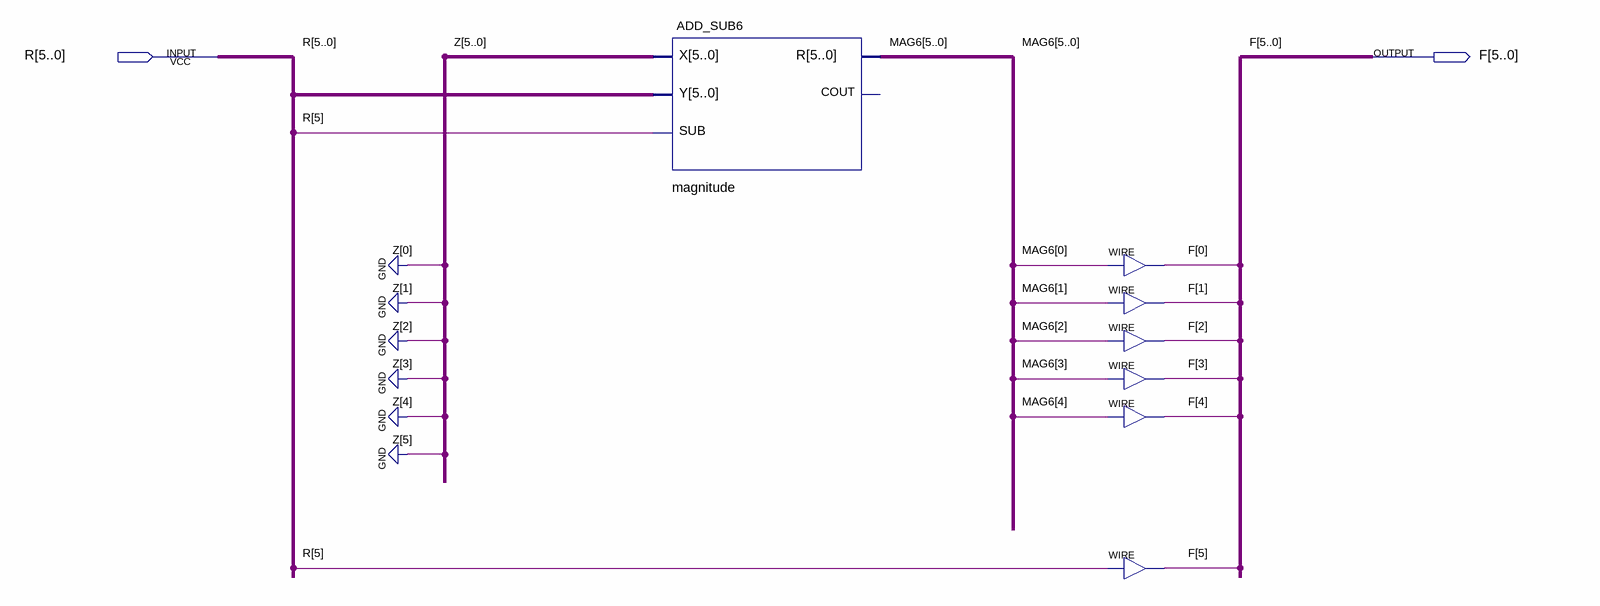
[diagram p0: schematic sheet]
// Quartus schematic C2_SM.bdf as structural Verilog: 7 symbols, 2 pins
module C2_SM (
  input  [5:0] R,
  output [5:0] F
);

  wire [5:0] MAG6;

  ADD_SUB6 magnitude (.X({6{1'b0}}), .Y(R), .SUB(R[5]), .R(MAG6));  // open: COUT
  assign F[0] = MAG6[0];  // WIRE map_F_0
  assign F[1] = MAG6[1];  // WIRE map_F_1
  assign F[2] = MAG6[2];  // WIRE map_F_2
  assign F[3] = MAG6[3];  // WIRE map_F_3
  assign F[4] = MAG6[4];  // WIRE map_F_4
  assign F[5] = R[5];  // WIRE map_F_5
endmodule
